# EasyEDA Pro project ProPrj_26-3-4手持装甲板_2026-06-27.epro

# Schematic Schematic2
Assembly Variant: Basic; Board Name: Board2; Create Date: 2026-03-23; Page Name: P1; Project Name: 26-3-4手持装甲板; Schematic Name: Schematic2; Update Date: 2026-03-23; BladeWidth: 10; Company: 嘉立创EDA; Page Size: A4; RegionStart: 1; ShowBorder: 1; TitleBlock: 1; TitleBlockPosition: 3; Version: V1.0; XRegionCount: 6; YRegionCount: 4
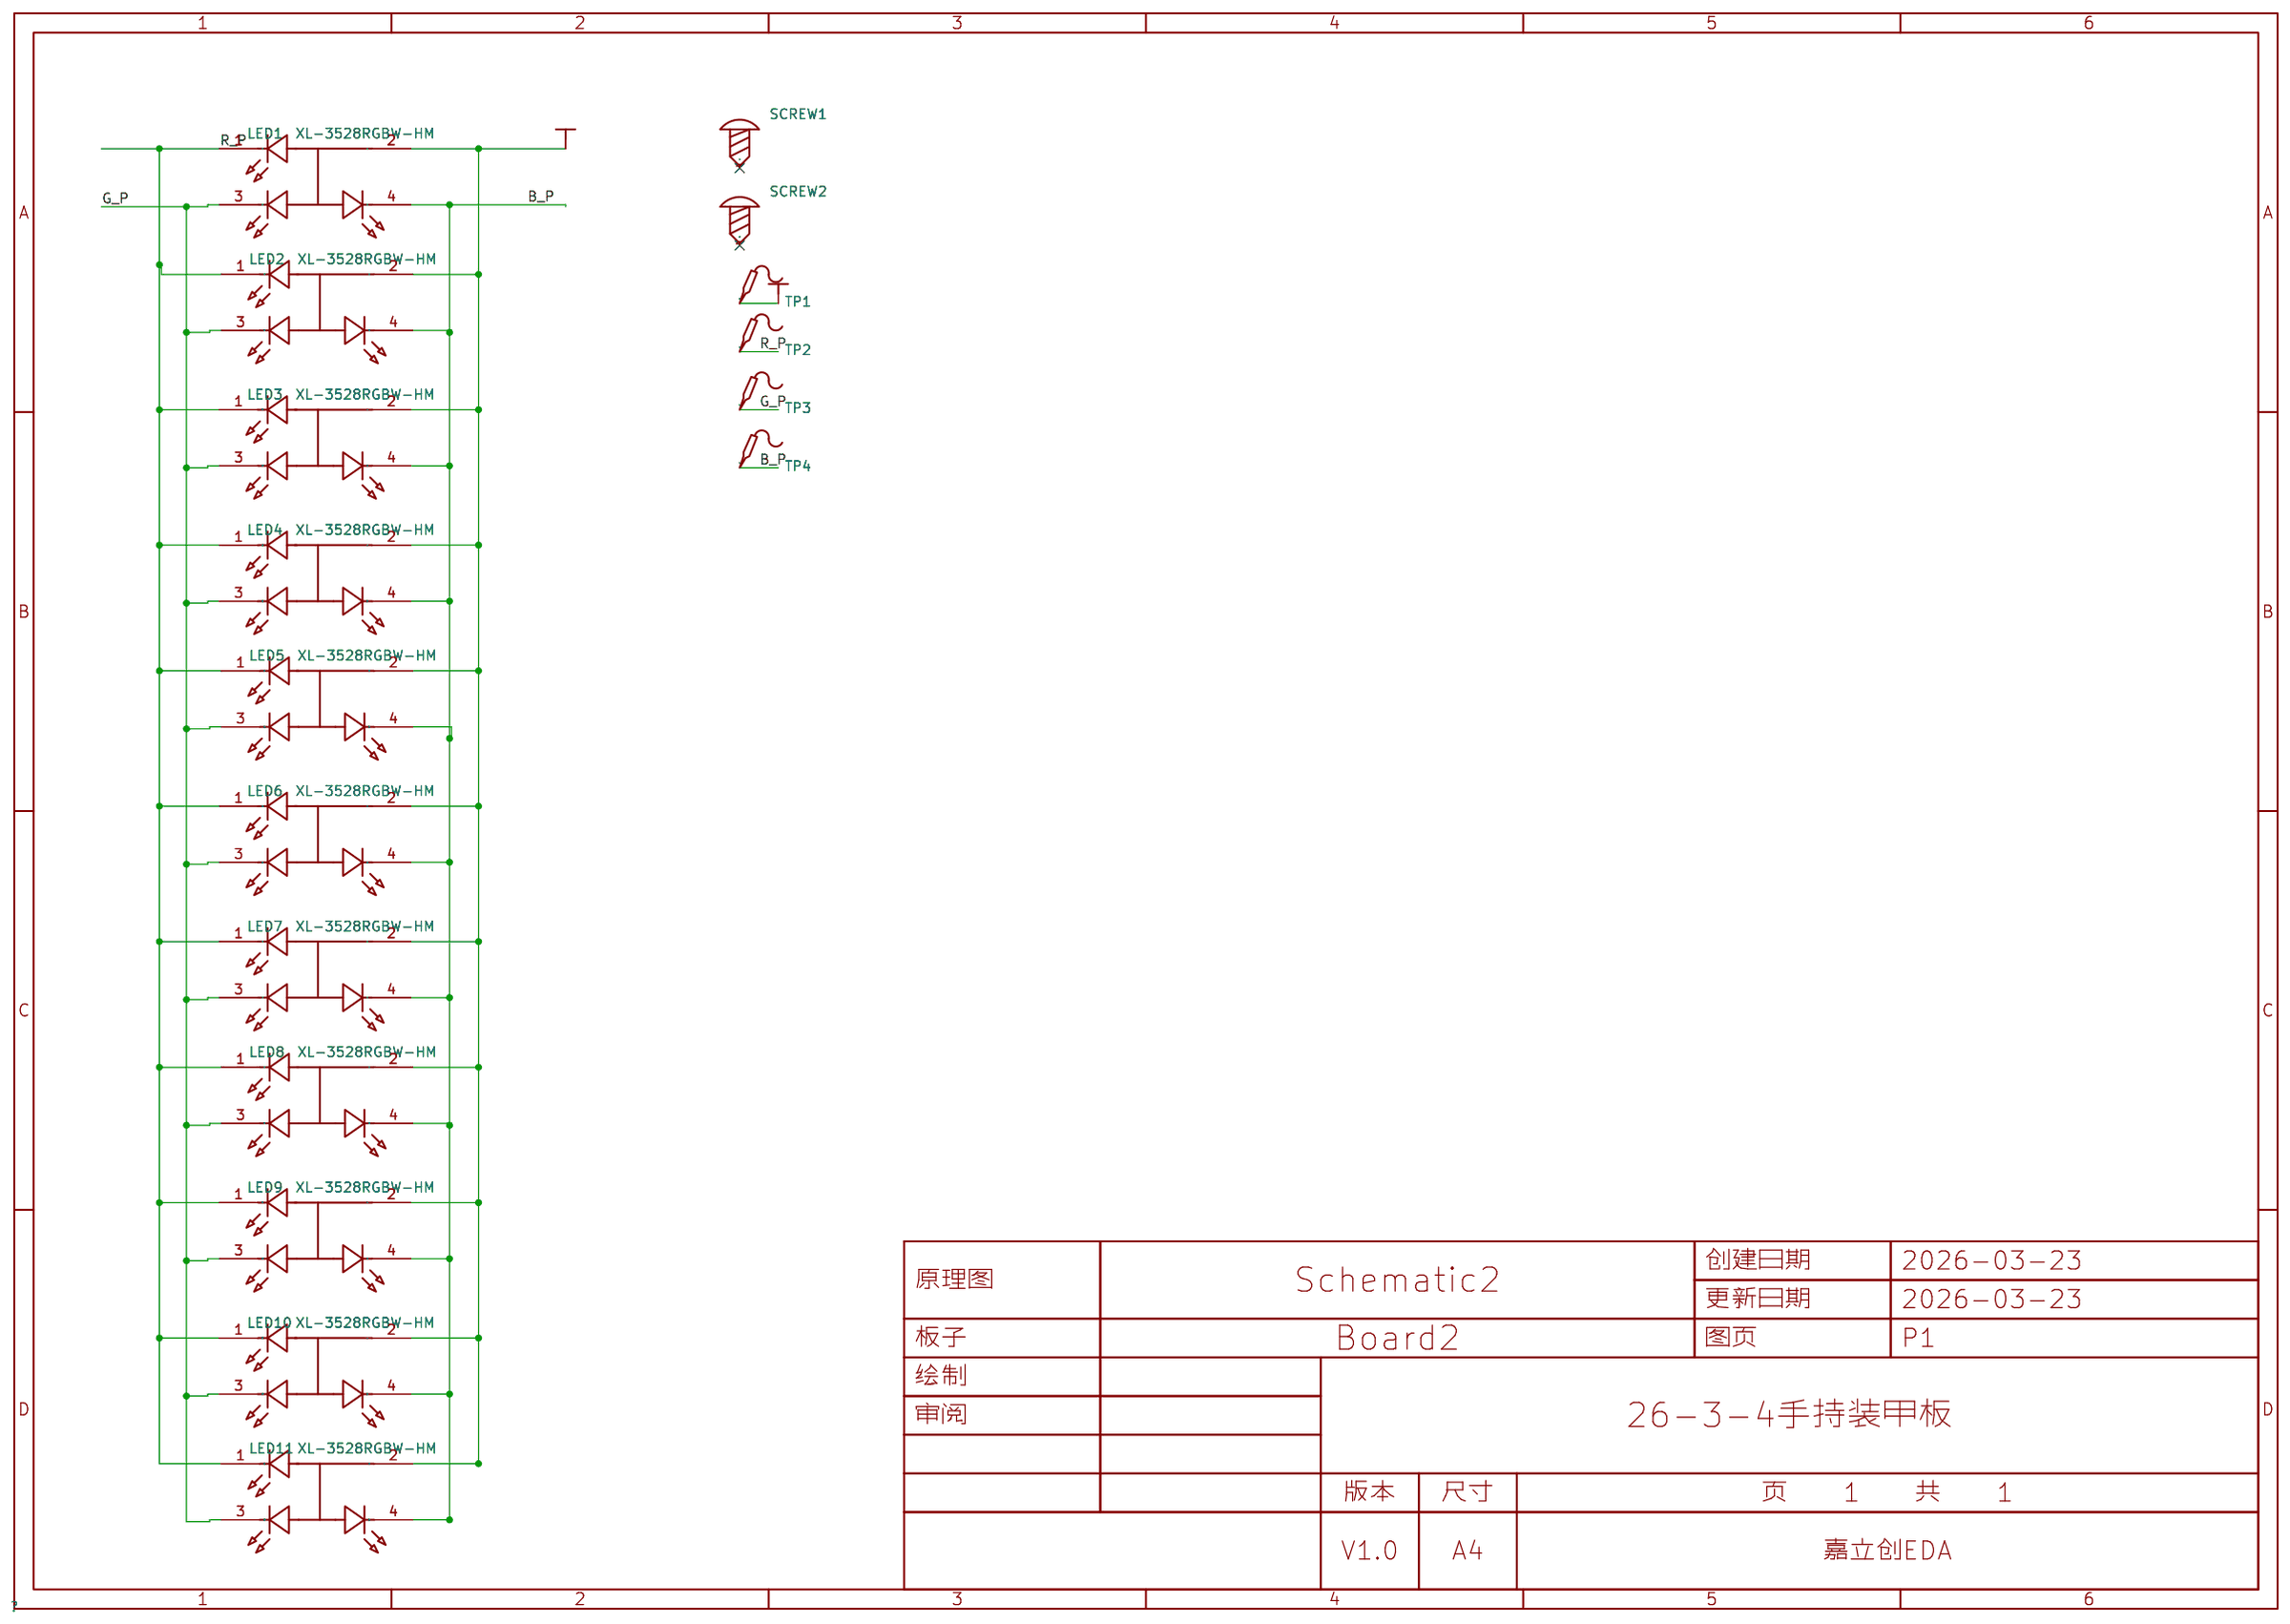
[diagram p0: schematic sheet]

## Parts
LED1  XL-3528RGBW-HM  [LED-SMD_4P-L3.2-W2.8-LS3.5-XL-3528RGBW-HM5]
LED2  XL-3528RGBW-HM  [LED-SMD_4P-L3.2-W2.8-LS3.5-XL-3528RGBW-HM5]
LED3  XL-3528RGBW-HM  [LED-SMD_4P-L3.2-W2.8-LS3.5-XL-3528RGBW-HM5]
LED4  XL-3528RGBW-HM  [LED-SMD_4P-L3.2-W2.8-LS3.5-XL-3528RGBW-HM5]
LED5  XL-3528RGBW-HM  [LED-SMD_4P-L3.2-W2.8-LS3.5-XL-3528RGBW-HM5]
LED6  XL-3528RGBW-HM  [LED-SMD_4P-L3.2-W2.8-LS3.5-XL-3528RGBW-HM5]
LED7  XL-3528RGBW-HM  [LED-SMD_4P-L3.2-W2.8-LS3.5-XL-3528RGBW-HM5]
LED8  XL-3528RGBW-HM  [LED-SMD_4P-L3.2-W2.8-LS3.5-XL-3528RGBW-HM5]
LED9  XL-3528RGBW-HM  [LED-SMD_4P-L3.2-W2.8-LS3.5-XL-3528RGBW-HM5]
LED10  XL-3528RGBW-HM  [LED-SMD_4P-L3.2-W2.8-LS3.5-XL-3528RGBW-HM5]
LED11  XL-3528RGBW-HM  [LED-SMD_4P-L3.2-W2.8-LS3.5-XL-3528RGBW-HM5]
SCREW1  -  [M2螺丝]
SCREW2  -  [M2螺丝]
TP1  -  [Test-Point-0.5mm]
TP2  -  [Test-Point-0.5mm]
TP3  -  [Test-Point-0.5mm]
TP4  -  [Test-Point-0.5mm]

## Library data of the parts
LED1-LED11 = XL-3528RGBW-HM: 3528七彩黑面贴片LED灯珠; LCSC Part Name: 3528七彩雾状共阳贴片式发光二极管; Supplier Part: C2843813; Manufacturer: XINGLIGHT(成兴光); Supplier Footprint: SMD3528-4P; JLCPCB Part Class: Extended Part; Datasheet: https://item.szlcsc.com/datasheet/XL-3528RGBW-HM/3033164.html; Supplier: LCSC; Diode Configuration: 共阳极; Wavelength - Dominant: G:515nm~530nm；B:460nm~475nm；R:620nm~630nm; Peak Wavelength: G:525nm；R:625nm；B:465nm; Luminous Intensity: B:120mcd~180mcd；G:400mcd~600mcd；R:150mcd~200mcd; Viewing Angle: 120°; Forward Current: R:20mA；B:20mA；G:20mA; Forward Voltage(Vf): R:1.8V~2.2V；G:2.9V~3.2V；B:3.0V~3.3V; Antistatic Capacity: B:2000V；R:2000V；G:2000V; Power(Watts): G:70mW；B:70mW；R:50mW; Installation Method: 正贴; Operating Temperature: -20℃~+85℃; Length: 3.5mm; Width: 2.8mm; Height: 1.9mm
SCREW1 SCREW2 = M2螺丝: Supplier Footprint: 插件
TP1-TP4 = Test-Point: Test Point 测试点

## Nets
+5V: LED1.2(+) LED2.2(+) LED3.2(+) LED4.2(+) LED5.2(+) LED6.2(+) LED7.2(+) LED8.2(+) LED9.2(+) LED10.2(+) LED11.2(+) TP1.1
B_P: LED1.4(B-) LED2.4(B-) LED3.4(B-) LED4.4(B-) LED5.4(B-) LED6.4(B-) LED7.4(B-) LED8.4(B-) LED9.4(B-) LED10.4(B-) LED11.4(B-) TP4.1
G_P: LED1.3(G-) LED2.3(G-) LED3.3(G-) LED4.3(G-) LED5.3(G-) LED6.3(G-) LED7.3(G-) LED8.3(G-) LED9.3(G-) LED10.3(G-) LED11.3(G-) TP3.1
R_P: LED1.1(R-) LED2.1(R-) LED3.1(R-) LED4.1(R-) LED5.1(R-) LED6.1(R-) LED7.1(R-) LED8.1(R-) LED9.1(R-) LED10.1(R-) LED11.1(R-) TP2.1

Not connected (* = marked no-connect by the designer): SCREW1 1*; SCREW2 1*

# Schematic Schematic1
Assembly Variant: Basic; Board Name: Board1; Create Date: 2026-03-04; Page Name: P1; Project Name: 26-3-4手持装甲板; Schematic Name: Schematic1; Update Date: 2026-03-04; BladeWidth: 10; Company: 嘉立创EDA; Page Size: A4; RegionStart: 1; ShowBorder: 1; TitleBlock: 1; TitleBlockPosition: 3; Version: V1.0; XRegionCount: 6; YRegionCount: 4
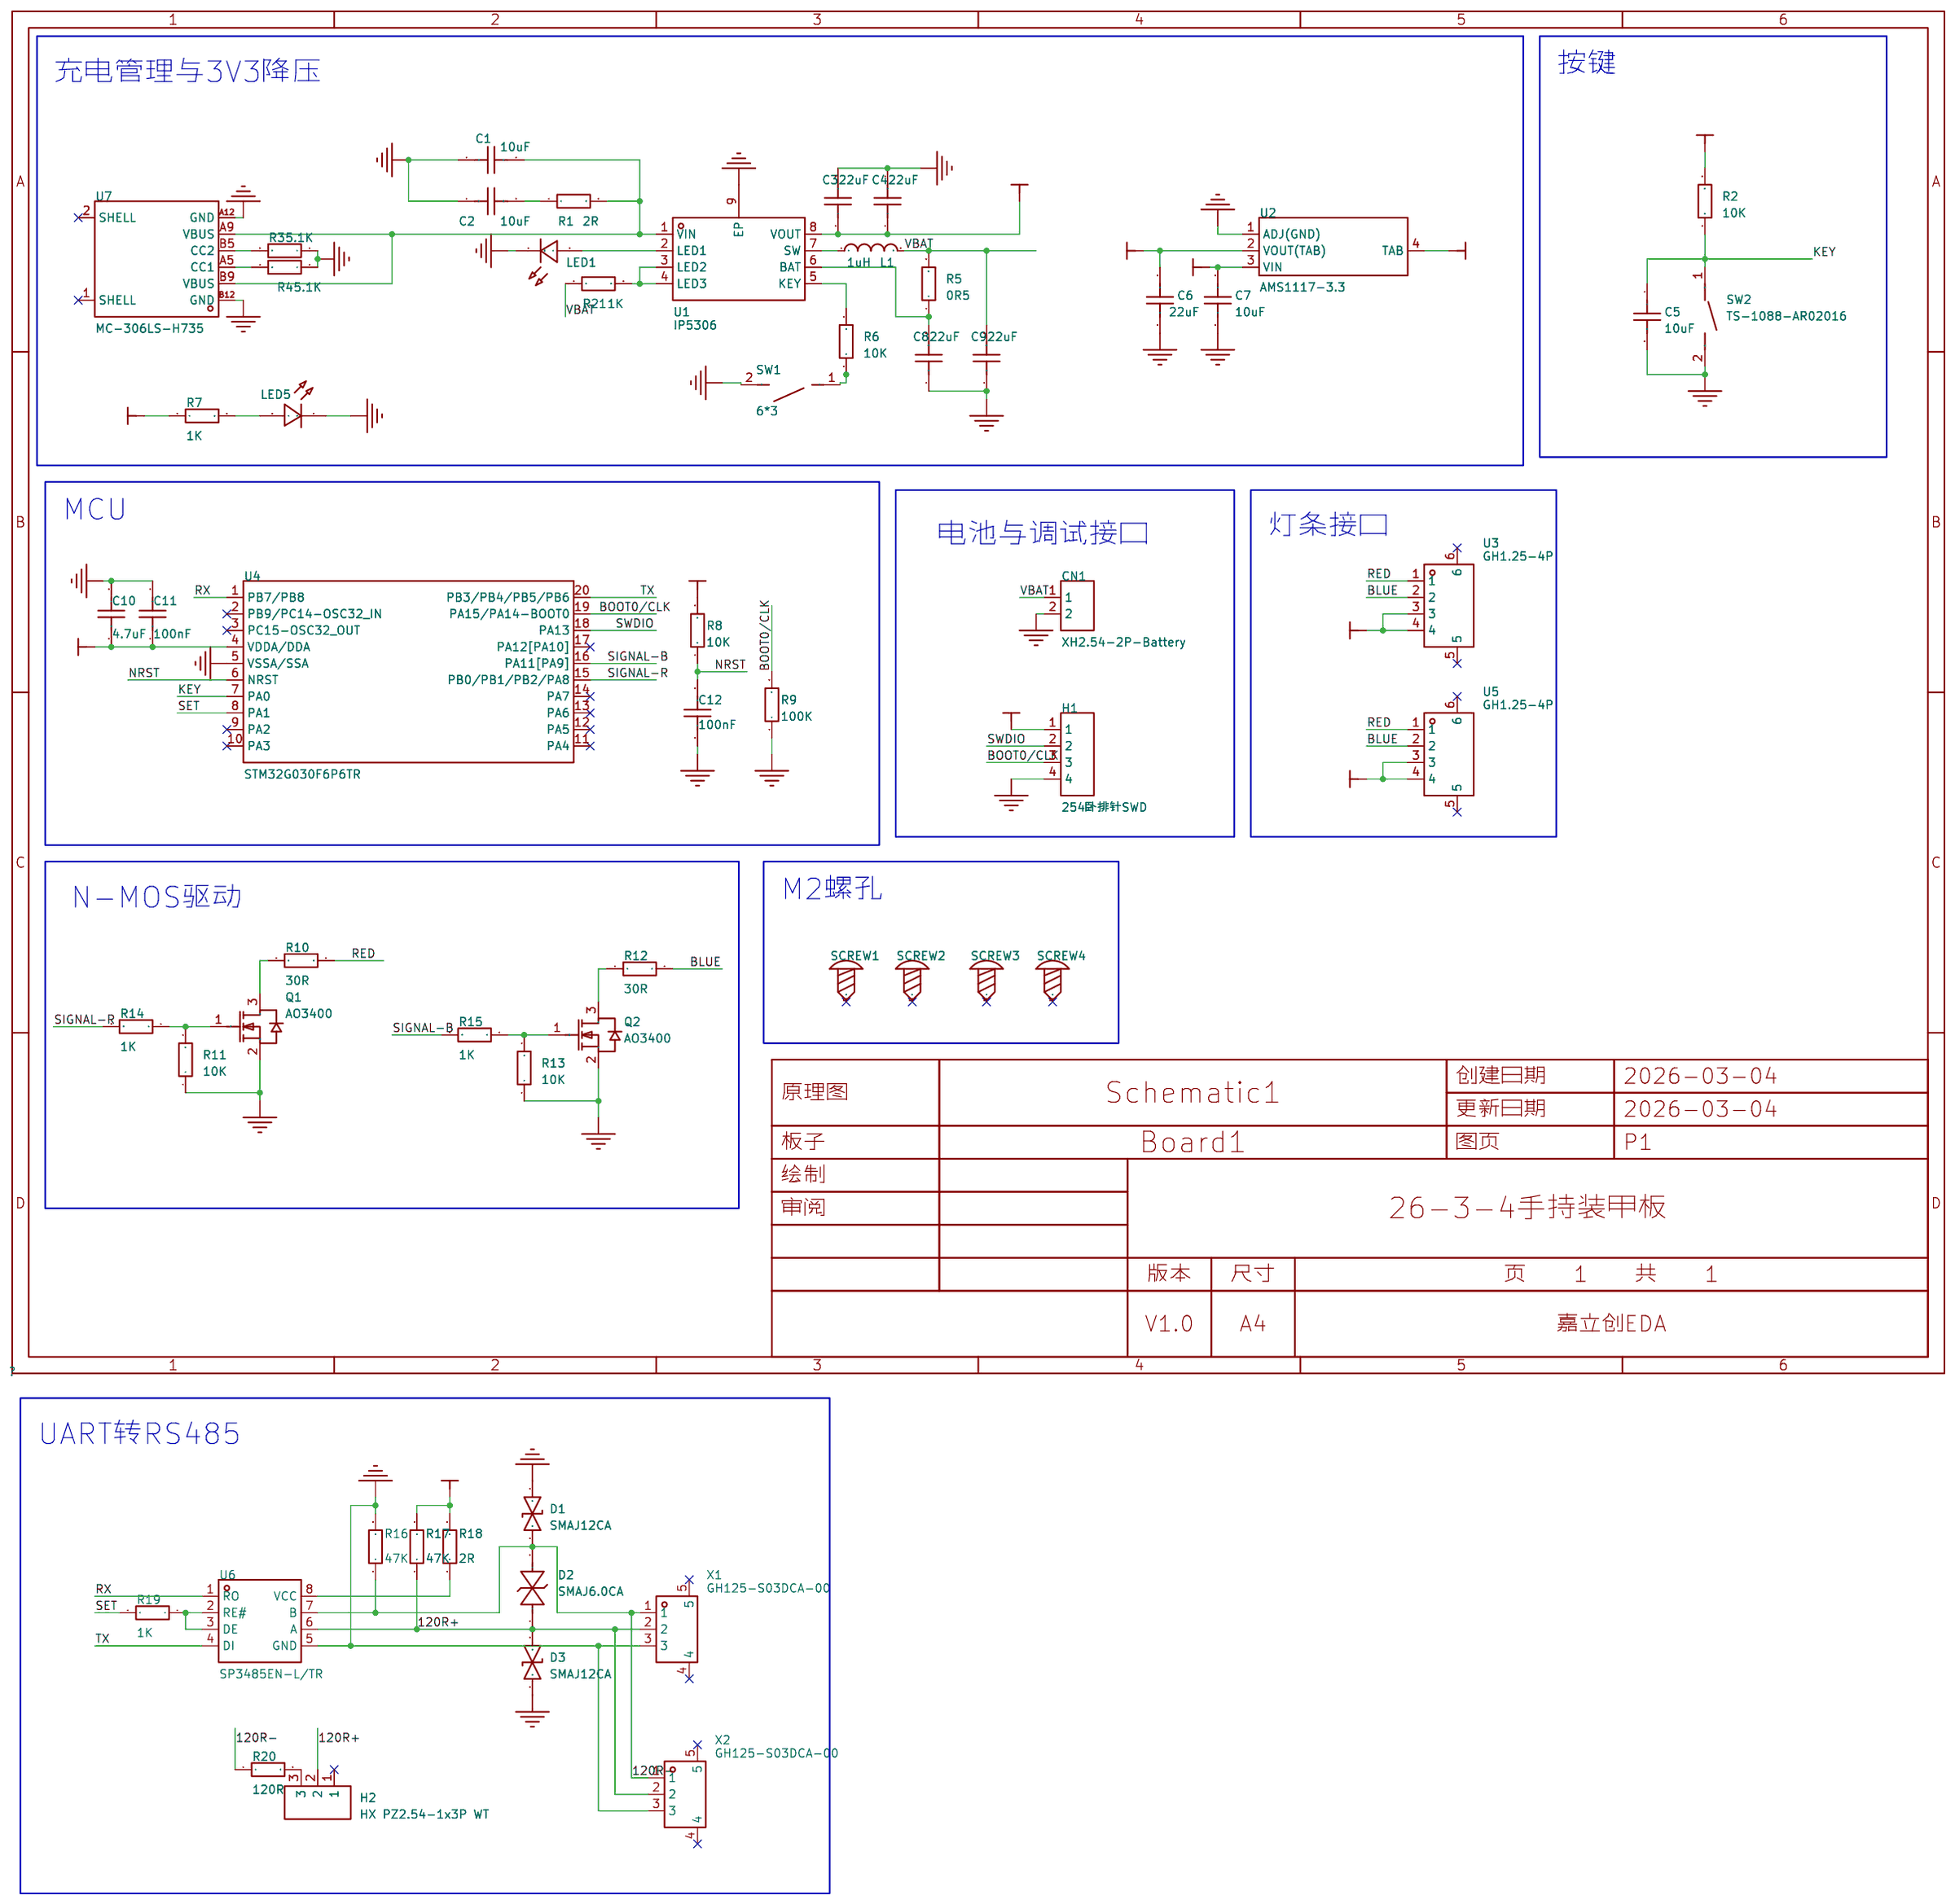
[diagram p1: schematic sheet]

## Parts
C1  10uF  [C0603]
C2  10uF  [C0603]
C3  22uF  [C0603]
C4  22uF  [C0603]
C5  10uF  [C0603]
C6  22uF  [C0603]
C7  10uF  [C0603]
C8  22uF  [C0603]
C9  22uF  [C0603]
C10  4.7uF  [C0603]
C11  100nF  [C0603]
C12  100nF  [C0603]
CN1  XH2.54-2P-Battery  [CONN-TH_2P-P2.50_HX-2.54MM-2P-ZZ-MS]
D1  SMAJ12CA  [SMA_L4.3-W2.6-LS5.0-BI]
D2  SMAJ6.0CA  [SMA_L4.3-W2.6-LS5.0-BI]
D3  SMAJ12CA  [SMA_L4.3-W2.6-LS5.0-BI]
H1  254卧排针SWD  [HDR-TH_4P-P2.54-H-M-W10.4]
H2  HX PZ2.54-1x3P WT  [HDR-SMD_3P-P2.54-H-M_KH-2.54PH-1X3P-L13.5-WT]
L1  1uH  [IND-SMD_L7.1-W6.6_DH0630H-R82M]
LED1  -  [LED_0603]
LED5  -  [LED_0603]
Q1  AO3400  [SOT-23_L2.9-W1.3-P1.90-LS2.4-BR]
Q2  AO3400  [SOT-23_L2.9-W1.3-P1.90-LS2.4-BR]
R1  2R  [R0603]
R2  10K  [R0603]
R3  5.1K  [R0603]
R4  5.1K  [R0603]
R5  0R5  [R0603]
R6  10K  [R0603]
R7  1K  [R0603]
R8  10K  [R0603]
R9  100K  [R0603]
R10  30R  [R0603]
R11  10K  [R0603]
R12  30R  [R0603]
R13  10K  [R0603]
R14  1K  [R0603]
R15  1K  [R0603]
R16  47K  [R0603]
R17  47K  [R0603]
R18  2R  [R0603]
R19  1K  [R0603]
R20  120R  [R0603]
R21  1K  [R0603]
SCREW1  -  [M2螺丝]
SCREW2  -  [M2螺丝]
SCREW3  -  [M2螺丝]
SCREW4  -  [M2螺丝]
SW1  6*3  [SW-SMD_L6.1-W3.6-LS7.0_YTS1C0161BBJ00]
SW2  TS-1088-AR02016  [SW-SMD_L3.9-W3.0-P4.45]
U1  IP5306  [ESOP-8_L4.9-W3.9-P1.27-LS6.0-BL-EP]
U2  AMS1117-3.3  [SOT-223-4_L6.5-W3.5-P2.30-LS7.0-BR]
U3  GH1.25-4P  [CONN-SMD_4P-P1.25_XUNPU_WAFER-GH1.25-4PWB]
U4  STM32G030F6P6TR  [TSSOP-20_L6.5-W4.4-P0.65-LS6.4-BL]
U5  GH1.25-4P  [CONN-SMD_4P-P1.25_XUNPU_WAFER-GH1.25-4PWB]
U6  SP3485EN-L/TR  [SOIC-8_L5.0-W4.0-P1.27-LS6.0-BL]
U7  MC-306LS-H735  [USB-C-SMD_MC-306LS-H60]
X1  GH125-S03DCA-00  [CONN-SMD_3P-P1.25_JUSHUO_GH125-S03DCA-00]
X2  GH125-S03DCA-00  [CONN-SMD_3P-P1.25_JUSHUO_GH125-S03DCA-00]

## Library data of the parts
C1-C5 C8-C12 = CAP_0603: Supplier Footprint: 0603
C6 C7 = CGA0603X7R104K500JT: 容值:100nF;精度:±10%;额定电压:50V;温度系数:X7R;; LCSC Part Name: 100nF ±10% 50V; Supplier Part: C6119867; Manufacturer: HRE(芯声); Supplier Footprint: 0603; JLCPCB Part Class: Extended Part; Datasheet: https://item.szlcsc.com/datasheet/CGA0603X7R104K500JT/7062573.html; Supplier: LCSC; Tolerance: ±10%; Voltage Rating: 50V; Temperature Coefficient: X7R
CN1 = HX-XH2.54-2PZZ: 插针结构:1x2P;间距:2.54mm;安装方式:直插;参考系列:XH;总PIN数:2P;排数:1;每排PIN数:2;行距:-;额定电流:3A;触头材质:黄铜;触头镀层:锡;工作温度:-25℃~+85℃;; LCSC Part Name: 1x2P 间距:2.5mm 直插 系列:XH; Supplier Part: C42391660; Manufacturer: hanxia(韩下); Supplier Footprint: 插件,P=2.5mm; JLCPCB Part Class: Extended Part; Datasheet: https://item.szlcsc.com/datasheet/HX-XH2.54-2PZZ/44326932.html; Supplier: LCSC; Pins Structure: 1x2P; Pitch: 2.54mm; Mounting Type: 直插; Reference Series: XH; Number of Pins: 2P; Number of Rows: 1; Number of PINs Per Row: 2; Current Rating: 3A; Contact Material: 黄铜; Contact Plating: 锡; Operating Temperature: -25℃~+85℃; Voltage Rating: 250V; Plastic Material: PA66; Flame Retardant Rating: UL94V-0; Color: 白色
D1 D3 = SMAJ12CA_C19077532: 极性:双向;反向截止电压(Vrwm):12V;钳位电压:19.9V;峰值脉冲电流(Ipp):20.1A@10/1000us;峰值脉冲功率(Ppp):400W@10/1000us;击穿电压:14.7V;; LCSC Part Name: 双向TVS 12V截止 峰值浪涌电流：20.1A@10/1000us; Supplier Part: C19077532; Manufacturer: R+O(宏嘉诚); Supplier Footprint: DO-214AC(SMA); JLCPCB Part Class: Extended Part; Datasheet: https://item.szlcsc.com/datasheet/SMAJ12CA/20275617.html; Supplier: LCSC; Polarity: 双向; Reverse Stand-Off Voltage (Vrwm): 12V; Clamping Voltage: 19.9V; Peak Pulse Current (Ipp): 20.1A@10/1000us; Peak Pulse Power Dissipation (Ppp): 400W@10/1000us; Voltage - Breakdown: 14.7V; Reverse Leakage Current (Ir): 1uA; Number of Channels: 单路; Operating Temperature: -55℃~+150℃; level of protection: IEC 61000-4-2; Type: TVS
D2 = SMAJ6.0CA_C19077526: 极性:双向;反向截止电压(Vrwm):6V;钳位电压:10.3V;峰值脉冲电流(Ipp):38.8A@10/1000us;峰值脉冲功率(Ppp):400W@10/1000us;击穿电压:7.37V;; LCSC Part Name: 双向TVS 6V截止 峰值浪涌电流：38.8A@10/1000us; Supplier Part: C19077526; Manufacturer: R+O(宏嘉诚); Supplier Footprint: DO-214AC(SMA); JLCPCB Part Class: Extended Part; Datasheet: https://item.szlcsc.com/datasheet/SMAJ6.0CA/20275611.html; Supplier: LCSC; Polarity: 双向; Reverse Stand-Off Voltage (Vrwm): 6V; Clamping Voltage: 10.3V; Peak Pulse Current (Ipp): 38.8A@10/1000us; Peak Pulse Power Dissipation (Ppp): 400W@10/1000us; Voltage - Breakdown: 7.37V; Reverse Leakage Current (Ir): 800uA; Number of Channels: 单路; Operating Temperature: -55℃~+150℃; level of protection: IEC 61000-4-2; Type: TVS
H1 = PZ254R-11-04P: 插针结构:1x4P;间距:2.54mm;行距:-;圆针/方针:方针;安装方式:弯插;排数:单排;总PIN位数:4P;额定电流:-;额定电压:-;配合针长度:6mm;塑高:2.5mm;触头材质:黄铜;触头镀层:-;工作温度:-40℃~+105℃;颜色:黑色;; LCSC Part Name: 1x4P 间距:2.54mm 方针 弯插; Supplier Part: C492412; Manufacturer: XFCN(兴飞); Supplier Footprint: 弯插,P=2.54mm; JLCPCB Part Class: Extended Part; Datasheet: https://item.szlcsc.com/datasheet/PZ254R-11-04P/502968.html; Supplier: LCSC; Pin Structure: 1x4P; Pitch: 2.54mm; Circluar Pins/Square Pins: 方针; Mounting Type: 弯插; Number of Rows: 单排; Number of Pins: 4P; Length of Mating Pin: 6mm; Insulation Height: 2.5mm; Contact Material: 黄铜; Operating Temperature: -40℃~+105℃; Color: 黑色
H2 = HX PZ2.54-1x3P WT: 插针结构:1x3P;间距:2.54mm;行距:-;圆针/方针:方针;安装方式:卧贴;排数:单排;总PIN位数:3P;额定电流:3A;额定电压:1kV;配合针长度:6mm;塑高:2.5mm;端接针长度:-;触头材质:黄铜;触头镀层:金;工作温度:-40℃~+105℃;颜色:黑色;; LCSC Part Name: 配套排母：HX PM2.54-1x3P系列 1x3P 间距:2.54mm 方针 卧贴; Supplier Part: C46061676; Manufacturer: hanxia(韩下); Supplier Footprint: SMD,P=2.54mm,卧贴; JLCPCB Part Class: Extended Part; Datasheet: https://item.szlcsc.com/datasheet/HX%2520PZ2.54-1x3P%2520WT/48170536.html; Supplier: LCSC; Pin Structure: 1x3P; Pitch: 2.54mm; Circluar Pins/Square Pins: 方针; Mounting Type: 卧贴; Number of Rows: 单排; Number of Pins: 3P; Current Rating: 3A; Voltage Rating (Max): 1kV; Length of Mating Pin: 6mm; Insulation Height: 2.5mm; Contact Material: 黄铜; Contact Plating: 金; Operating Temperature: -40℃~+105℃; Color: 黑色
L1 = DH0630H-R82M: 电感值:820nH;精度:±20%;额定电流:11A;饱和电流(Isat):20A;类型:一体成型电感;; LCSC Part Name: DH0630H-R82M（0.82uH); Supplier Part: C41407091; Manufacturer: DH(德鸿感应); Supplier Footprint: SMD,7.1x6.6mm; Datasheet: https://item.szlcsc.com/datasheet/DH0630H-R82M/43206132.html; Supplier: LCSC; Tolerance: ±20%; Current Rating: 11A; Current - Saturation(Isat): 20A; DC Resistance(DCR): 5.6mΩ; Type: 一体成型电感
LED1 LED5 = LED_0603-G: Supplier Footprint: 0603
Q1 Q2 = AO3400_C2938367: 数量:1个N沟道;漏源电压(Vdss):30V;连续漏极电流(Id):5.8A;导通电阻(RDS(on)):28mΩ@10V;耗散功率(Pd):1.5W;阈值电压(Vgs(th)):1.4V@250uA;; LCSC Part Name: 1个N沟道 耐压:30V 电流:5.8A; Supplier Part: C2938367; Manufacturer: GOODWORK(固得沃克); Supplier Footprint: SOT-23; JLCPCB Part Class: Extended Part; Datasheet: https://item.szlcsc.com/datasheet/AO3400/3294704.html; Supplier: LCSC; Number: 1个N沟道; Drain to Source Voltage: 30V; Current - Continuous Drain(Id): 5.8A; RDS(on): 28mΩ@10V; Pd - Power Dissipation: 1.5W; Gate Threshold Voltage (Vgs(th)): 1.4V@250uA; Input Capacitance(Ciss): 1.05nF; Reverse Transfer Capacitance (Crss@Vds): 77pF@15V; Operating Temperature: -55℃~+150℃; Type: N沟道
R1-R21 = Res_0603: Supplier Footprint: 0603
SCREW1-SCREW4 = M2螺丝: Supplier Footprint: 插件
SW1 = YTS1C0161BBJ00: 电路结构:单刀单掷;按钮形状:矩形按钮;作用力:1.8N;安装方式:立贴;开关长度:6mm;开关宽度:3mm;开关高度:5mm;带支架:不带支架;触点电流:50mA;额定电压:12V;带灯:无;; LCSC Part Name: 3X6X5 160gf 黑钮翘脚; Supplier Part: C5451708; Manufacturer: YIYUAN(怡远); Supplier Footprint: SMD,6x3mm; JLCPCB Part Class: Extended Part; Datasheet: https://item.szlcsc.com/datasheet/YTS1C0161BBJ00/6355620.html; Supplier: LCSC; Circuit: 单刀单掷; Actuator Style: 矩形按钮; Operating Force: 1.8N; Mounting Type: 立贴; Length: 6mm; Width: 3mm; Switch Height: 5mm; with Bracket: 不带支架; Contact Current: 50mA; Voltage Rating: 12V; Actuator/Cap Color: 黑色; With Lamp: 无; Termination Style: J型引脚
SW2 = TS-1088-AR02016: 电路结构:单刀单掷;按钮形状:圆形按钮;作用力:1.6N;安装方式:立贴;开关长度:4mm;开关宽度:3mm;开关高度:2mm;带支架:不带支架;触点电流:50mA;额定电压:12V;工作寿命:10万次;; LCSC Part Name: 4*3*2mm 立贴 轻触开关; Supplier Part: C720477; Manufacturer: XUNPU(讯普); Supplier Footprint: SMD,4x3mm; JLCPCB Part Class: Basic Part; Datasheet: https://item.szlcsc.com/datasheet/TS-1088-AR02016/763484.html; Supplier: LCSC; Circuit: 单刀单掷; Actuator Style: 圆形按钮; Operating Force: 1.6N; Mounting Type: 立贴; Length: 4mm; Width: 3mm; Switch Height: 2mm; with Bracket: 不带支架; Contact Current: 50mA; Voltage Rating: 12V; Actuator/Cap Color: 黑色; Termination Style: SMD接片; Life: 10万次; Operating Temperature: -30℃~+80℃
U1 = IP5306: 工作电压:4.65V~5.5V;最大充电电流:2.1A;电池类型:锂电池;电池节数:1;; LCSC Part Name: 集成2.1A充电器和2.1A放电器的全集成移动电源系统级芯片; Supplier Part: C181692; Manufacturer: INJOINIC(英集芯); Supplier Footprint: ESOP-8; JLCPCB Part Class: Extended Part; Datasheet: https://item.szlcsc.com/datasheet/IP5306/193089.html; Supplier: LCSC; The Chip Type: 充电芯片；保护芯片; Voltage - Supply: 4.65V~5.5V; Charge Current - Max: 2.1A; Charging Saturation Voltage: 4.2V; End-Off Voltage: 3V; Type of Battery: 锂电池; Number of Cells: 1; Operating Temperature: 0℃~+70℃; Supply Current (Iq): 100uA; Interface: I2C
U2 = AMS1117-3.3_C347222: 输出类型:固定;工作电压:12V;输出电压:3.3V;输出电流:1A;电源纹波抑制比(PSRR):60dB@(120Hz);输出极性:正极;; LCSC Part Name: 3.3V 1A 12V; Supplier Part: C347222; Manufacturer: UMW(友台半导体); Supplier Footprint: SOT-223; JLCPCB Part Class: Extended Part; Datasheet: https://item.szlcsc.com/datasheet/AMS1117-3.3/323882.html; Supplier: LCSC; Output Type: 固定; Voltage - Supply: 12V; Output Voltage: 3.3V; Output Current: 1A; Power Supply Rejection Ratio (PSRR): 60dB@(120Hz); Voltage Dropout: 1.3V@(1A); standby current: 5mA; Noise: 0.003%Vout; Features: 过流保护; Operating Temperature: -40℃~+125℃; Output Configuration: 正极; Number of Outputs: 1
U3 U5 = WAFER-GH1.25-4PWB: 插针结构:1x4P;间距:1.25mm;安装方式:卧贴;参考系列:GH;总PIN数:4P;排数:1;每排PIN数:4;行距:-;额定电流:1A;触头材质:黄铜;触头镀层:锡;工作温度:-25℃~+85℃;; LCSC Part Name: 1x4P 间距:1.25mm 卧贴 系列:GH; Supplier Part: C3029379; Manufacturer: XUNPU(讯普); Supplier Footprint: SMD,P=1.25mm,卧贴; JLCPCB Part Class: Extended Part; Datasheet: https://item.szlcsc.com/datasheet/WAFER-GH1.25-4PWB/3561391.html; Supplier: LCSC; Pins Structure: 1x4P; Pitch: 1.25mm; Mounting Type: 卧贴; Reference Series: GH; Number of Pins: 4P; Number of Rows: 1; Number of PINs Per Row: 4; Current Rating: 1A; Contact Material: 黄铜; Contact Plating: 锡; Operating Temperature: -25℃~+85℃; Voltage Rating: 125V; Plastic Material: LCP; Supplementary Features: 辅助焊脚; Color: 米色; Z-Height of the Board: 4.35mm; X-Length of Bottom Edge on Board (Spacing Line): 8.25mm; Y-Width of Bottom Edge on Board: 5mm
U4 = STM32G030F6P6TR: CPU内核:-;CPU最大主频:64MHz;; LCSC Part Name: 主流超值系列Arm Cortex-M0+ MCU，具有32 KB Flash存储器、8 KB RAM、64 MHz CPU、2x USART、定时器、ADC和通信接口，2-3.6V; Supplier Part: C529330; Manufacturer: ST(意法半导体); Supplier Footprint: TSSOP-20; JLCPCB Part Class: Extended Part; Datasheet: https://item.szlcsc.com/datasheet/STM32G030F6P6TR/549608.html; Supplier: LCSC; CPU Maximum Speed: 64MHz; Program Storage Size: 32KB; Program Memory Type: FLASH; Number of I/O: 17; ADC (Bit): 12bit; Voltage - Supply: 2V~3.6V
U6 = SP3485EN-L/TR: 类型:收发器;数据速率:10Mbps;; LCSC Part Name: SP3485 +3.3V低功耗半双工RS-485收发器，数据速率10Mbps; Supplier Part: C8963; Manufacturer: MaxLinear(迈凌); Supplier Footprint: SOIC-8; JLCPCB Part Class: Basic Part; Datasheet: https://item.szlcsc.com/datasheet/SP3485EN-L%252FTR/9482.html; Supplier: LCSC; Type: 收发器; Number of Drivers: 1; Number of Receivers: 1; Voltage - Supply: 3.3V; Data Rate: 10Mbps; Number of Nodes: 32; Operating Temperature: -40℃~+85℃; Supply Current (Iq): 2mA; Communication Mode: 半双工
U7 = MC-306LS-H735: 连接器类型:Type-C;协议标准:-;公母:母;安装方式:立贴;触点数量:6P;端口数量:1;额定电流 - 电源:3A;工作温度:-25℃~+85℃;; LCSC Part Name: Type-C 母 立贴; Supplier Part: C6332266; Manufacturer: HANBO(汉博); Supplier Footprint: SMD; JLCPCB Part Class: Extended Part; Datasheet: https://item.szlcsc.com/datasheet/MC-306LS-H735/7280506.html; Supplier: LCSC; Connector Type: Type-C; Gender: 母; Mounting Type: 立贴; Number of Contacts: 6P; Number of Ports: 1; Current Rating-Power: 3A; Voltage Rating: 20V; Connect-Disconnect Life: 3千次; Operating Temperature: -25℃~+85℃
X1 X2 = GH125-S03DCA-00: 插针结构:1x3P;间距:1.25mm;安装方式:卧贴;参考系列:GH;总PIN数:3P;排数:1;每排PIN数:3;行距:-;额定电流:1A;触头材质:磷青铜;触头镀层:锡;工作温度:-25℃~+85℃;; LCSC Part Name: 1x3P 间距:1.25mm 卧贴 系列:GH; Supplier Part: C2886766; Manufacturer: JS(钜硕电子); Supplier Footprint: SMD,P=1.25mm,卧贴; JLCPCB Part Class: Extended Part; Datasheet: https://item.szlcsc.com/datasheet/GH125-S03DCA-00/3101262.html; Supplier: LCSC; Pins Structure: 1x3P; Pitch: 1.25mm; Mounting Type: 卧贴; Reference Series: GH; Number of Pins: 3P; Number of Rows: 1; Number of PINs Per Row: 3; Current Rating: 1A; Contact Material: 磷青铜; Contact Plating: 锡; Operating Temperature: -25℃~+85℃; Voltage Rating: 50V; Plastic Material: LCP; Flame Retardant Rating: UL94V-0; Color: 米色; Z-Height of the Board: 4.05mm; X-Length of Bottom Edge on Board (Spacing Line): 7.05mm; Y-Width of Bottom Edge on Board: 4.25mm

## Nets
+3.3V: C6.1 C10.1 C11.1 H1.1 R2.2 R8.2 R17.2 R18.2 U2.2(VOUT(TAB)) U2.4(TAB) U4.4(VDDA/DDA)
+5V: C3.1 C4.1 C7.2 R7.1 U1.8(VOUT) U2.3(VIN) U3.3 U3.4 U5.3 U5.4
GND: C1.1 C2.1 C3.2 C4.2 C5.2 C6.2 C7.1 C8.1 C9.1 C10.2 C11.2 C12.1 CN1.2 D1.2 D3.1 H1.4 LED1.1(C) LED5.1(C) Q1.2(S) Q2.2(S) R3.1 R4.1 R9.1 R11.1 R13.1 R16.2 SW1.2 SW2.2 U1.9(EP) U2.1(ADJ(GND)) U4.5(VSSA/SSA) U6.5(GND) U7.A12(GND) U7.B12(GND) X1.3 X2.3
VBAT: C9.2 CN1.1 L1.2 R5.2 R21.1
120R+: D2.1(K) D3.2 H2.2 R17.1 U6.6(A) X1.2 X2.2
120R-: D1.1 D2.2(A) R16.1 R20.1 U6.7(B) X1.1 X2.1
BLUE: R12.2 U3.2 U5.2
BOOT0/CLK: H1.3 R9.2 U4.19(PA15/PA14-BOOT0)
KEY: C5.1 R2.1 SW2.1 U4.7(PA0)
NRST: C12.2 R8.1 U4.6(NRST)
RED: R10.2 U3.1 U5.1
RX: U4.1(PB7/PB8) U6.1(RO)
SET: R19.2 U4.8(PA1)
SIGNAL-B: R15.2 U4.16(PA11[PA9])
SIGNAL-R: R14.2 U4.15(PB0/PB1/PB2/PA8)
SWDIO: H1.2 U4.18(PA13)
TX: U4.20(PB3/PB4/PB5/PB6) U6.4(DI)
$1N12: R4.2 U7.A5(CC1)
$1N13: R3.2 U7.B5(CC2)
$1N16: C1.2 R1.2 U1.1(VIN) U7.A9(VBUS) U7.B9(VBUS)
$1N18: C2.2 R1.1
$1N30: L1.1 U1.7(SW)
$1N32: C8.2 R5.1 U1.6(BAT)
$1N34: R6.2 U1.5(KEY)
$1N36: R6.1 SW1.1
$1N44: LED5.2(A) R7.2
$1N72: Q1.1(G) R11.2 R14.1
$1N73: Q1.3(D) R10.1
$1N104: H2.3 R20.2
$1N114: R18.1 U6.8(VCC)
$1N119: R19.1 U6.2(RE#) U6.3(DE)
$1N129: Q2.1(G) R13.2 R15.1
$1N130: Q2.3(D) R12.1
$1N134: LED1.2(A) U1.2(LED1)
$1N135: R21.2 U1.3(LED2) U1.4(LED3)

Not connected (* = marked no-connect by the designer): H2 1*; SCREW1 1*; SCREW2 1*; SCREW3 1*; SCREW4 1*; U3 5* 6*; U4 2(PB9/PC14-OSC32_IN)* 3(PC15-OSC32_OUT)* 9(PA2)* 10(PA3)* 11(PA4)* 12(PA5)* 13(PA6)* 14(PA7)* 17(PA12[PA10])*; U5 5* 6*; U7 1(SHELL)* 2(SHELL)*; X1 4* 5*; X2 4* 5*

## Notes on the sheet
- 按键
- 充电管理与3V3降压
- MCU
- 灯条接口
- 电池与调试接口
- N-MOS驱动
- M2螺孔
- UART转RS485

# Board PCB2
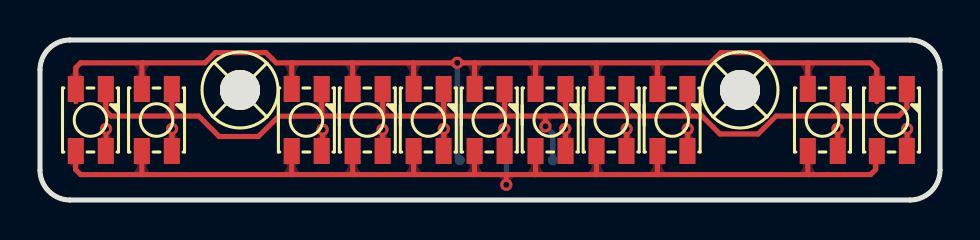
[diagram p2: board, top side]
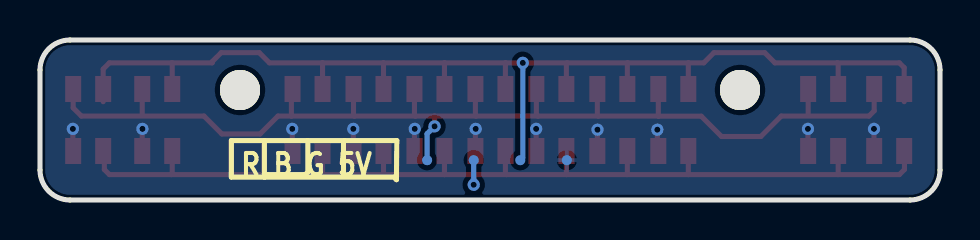
[diagram p3: board, bottom side, seen from below]

Outline 45 x 8 mm; copper layers: Top Layer, Bottom Layer. Coordinates in mm from the lower left corner of the outline.
Outline path: 0,6.5 0,1.5 arc(0.44,0.44) 1.5,0 43.5,0 arc(44.56,0.44) 45,1.5 45,6.5 arc(44.56,7.56) 43.5,8 1.5,8 arc(0.44,7.56) 0,6.5
Stack: Top Layer 0.035mm / Dielectric1 1.51mm FR4 er 4.5 / Bottom Layer 0.035mm

## Design rules (mm)
spacing copperThickness1oz (default): track to track 0.102, other pairs 0.152 to 0.3
spacing copperThickness2oz: track to track 0.203, other pairs 0.152 to 0.3
track width copperThickness1oz (default): min 0.127, default 0.254, max 2.54
track width copperThickness2oz: min 0.203, default 0.254, max 2.54
differential pair differentialPair (default): width min 0.127, default 0.254, max 2.54; gap min 0.152, default 0.152
net +5V uses copperRegion

## Placement (name value [footprint] x y rotation side)
LED1  XL-3528RGBW-HM  [LED-SMD_4P-L3.2-W2.8-LS3.5-XL-3528RGBW-HM5]  2.54 4 90 top
LED2  XL-3528RGBW-HM  [LED-SMD_4P-L3.2-W2.8-LS3.5-XL-3528RGBW-HM5]  5.84 4 90 top
LED3  XL-3528RGBW-HM  [LED-SMD_4P-L3.2-W2.8-LS3.5-XL-3528RGBW-HM5]  13.34 4 90 top
LED4  XL-3528RGBW-HM  [LED-SMD_4P-L3.2-W2.8-LS3.5-XL-3528RGBW-HM5]  16.38 4 90 top
LED5  XL-3528RGBW-HM  [LED-SMD_4P-L3.2-W2.8-LS3.5-XL-3528RGBW-HM5]  19.43 4 90 top
LED6  XL-3528RGBW-HM  [LED-SMD_4P-L3.2-W2.8-LS3.5-XL-3528RGBW-HM5]  22.48 4 90 top
LED7  XL-3528RGBW-HM  [LED-SMD_4P-L3.2-W2.8-LS3.5-XL-3528RGBW-HM5]  25.53 4 90 top
LED8  XL-3528RGBW-HM  [LED-SMD_4P-L3.2-W2.8-LS3.5-XL-3528RGBW-HM5]  28.57 4 90 top
LED9  XL-3528RGBW-HM  [LED-SMD_4P-L3.2-W2.8-LS3.5-XL-3528RGBW-HM5]  31.62 4 90 top
LED10  XL-3528RGBW-HM  [LED-SMD_4P-L3.2-W2.8-LS3.5-XL-3528RGBW-HM5]  39.14 4 90 top
LED11  XL-3528RGBW-HM  [LED-SMD_4P-L3.2-W2.8-LS3.5-XL-3528RGBW-HM5]  42.59 4 90 top
SCREW1  -  [M2螺丝]  10 5.5 0 top
SCREW2  -  [M2螺丝]  35 5.5 0 top
TP1  -  [Test-Point-0.5mm]  18.66 1.99 180 bottom
TP2  -  [Test-Point-0.5mm]  25.64 1.99 180 bottom
TP3  -  [Test-Point-0.5mm]  20.99 1.99 180 bottom
TP4  -  [Test-Point-0.5mm]  23.31 1.99 180 bottom

## Footprints (pads in the part's own frame, mm; a bottom-side part is the same pattern mirrored in y, then rotated)
LED-SMD_4P-L3.2-W2.8-LS3.5-XL-3528RGBW-HM5
  rect 1.3x0.8 smd: 1(1.55,-0.75) 2(-1.55,-0.75) 3(1.55,0.75) 4(-1.55,0.75)
M2螺丝
  round 2 hole 2: 1(0,0)
Test-Point-0.5mm
  round 0.5 smd: 1(0,0)

## Nets
As in the schematic.

Pads without a net: SCREW1 1; SCREW2 1

## Via types
v1: diameter 0.61, hole 0.305, Top Layer to Bottom Layer, 14 vias

## Routing (per net, layer and track width the routed paths; a pad name or vN(x,y) marks a point on that pad's centre or on a via; arc(x,y) is an arc through that point)
+5V: length 12.2
  Top Layer w0.254: v1(17.13,3.52) 17.13,3.51 LED4.2 ; LED2.2 6.6,2.46 v1(6.6,3.56) ; LED11.2 43.36,2.47 v1(43.36,3.56) ; LED6.2 23.23,3.54 v1(23.22,3.56) ; v1(39.88,3.56) 39.89,3.55 LED10.2 ; LED1.2 3.3,2.46 v1(3.3,3.56) ; LED9.2 32.39,2.46 v1(32.39,3.56) ; LED3.2 14.13,2.5 v1(14.13,3.52) ; LED8.2 29.34,2.46 v1(29.34,3.56) ; LED7.2 26.28,3.54 v1(26.26,3.56) ; LED5.2 20.19,2.46 v1(20.19,3.56)
B_P: length 55.5
  Top Layer w0.254: 18.68,1.27 15.66,1.27 ; 18.68,1.27 21.68,1.27 ; 18.68,1.27 18.68,2.45 ; 15.66,1.27 15.63,1.29 LED4.4 ; 15.66,1.27 12.59,1.27 ; 21.68,1.27 21.73,1.32 LED6.4 ; 21.68,1.27 23.28,1.27 ; 30.91,1.27 24.77,1.27 ; 30.91,1.27 30.87,1.3 LED9.4 ; 30.91,1.27 38.44,1.27 ; 41.84,2.96 41.78,2.9 41.78,1.52 41.53,1.27 38.44,1.27 ; 5.1,1.27 2.03,1.27 1.78,1.52 1.78,2.95 1.79,2.96 ; 5.1,1.27 12.59,1.27 ; 5.1,1.27 5.09,1.28 LED2.4 ; LED7.4 24.78,1.27 24.77,1.27 ; 24.77,1.27 23.28,1.27 ; 38.44,1.27 38.39,1.32 LED10.4 ; 23.28,1.27 23.31,1.24 v1(23.31,0.76) ; 12.59,1.27 12.59,1.28 LED3.4 ; LED8.4 27.82,1.27
  Bottom Layer w0.254: TP4.1 v1(23.31,0.76)
G_P: length 61.2
  Top Layer w0.254: 15.62,6.86 15.63,6.85 LED4.3 ; 15.62,6.86 12.58,6.86 ; 15.62,6.86 18.65,6.86 ; 38.4,6.86 41.53,6.86 41.84,6.55 41.84,4.92 ; 38.4,6.86 38.39,6.84 LED10.3 ; 38.4,6.86 36.39,6.86 36.39,6.92 35.94,7.37 34.04,7.37 33.53,6.86 30.87,6.86 ; 1.79,4.92 1.79,6.62 2.03,6.86 5.13,6.86 ; 18.65,6.86 18.68,6.82 LED5.3 ; 18.65,6.86 v1(20.86,6.86) 21.73,6.86 ; 27.83,6.86 30.87,6.86 ; 27.83,6.86 24.78,6.86 ; 27.83,6.86 27.82,6.85 LED8.3 ; 30.87,6.86 30.87,6.86 LED9.3 ; 12.58,6.86 12.59,6.86 LED3.3 ; 12.58,6.86 11.81,6.86 11.3,7.37 8.76,7.37 8.25,6.86 5.13,6.86 ; 21.73,6.86 24.78,6.86 ; 21.73,6.86 21.73,6.86 LED6.3 ; 24.78,6.86 24.78,6.86 LED7.3 ; LED2.3 5.09,6.82 5.13,6.86
  Bottom Layer w0.254: TP3.1 20.86,2.12 v1(20.86,6.86)
R_P: length 58.4
  Top Layer w0.254: 26.23,4.2 23.2,4.2 ; 26.23,4.2 26.28,4.24 LED7.1 ; 26.23,4.2 29.28,4.2 ; 23.2,4.2 20.1,4.2 ; 23.2,4.2 23.23,4.22 LED6.1 ; 20.1,4.2 17.09,4.2 ; 20.1,4.2 20.18,4.28 LED5.1 ; 32.43,4.2 32.43,5.49 LED9.1 ; 32.43,4.2 33.1,4.2 34,3.3 35.91,3.3 36.8,4.2 42.93,4.2 43.34,4.61 LED11.1 ; 32.43,4.2 29.28,4.2 ; LED8.1 29.32,4.24 29.28,4.2 ; 17.09,4.2 14.07,4.2 ; 17.09,4.2 17.13,4.24 LED4.1 ; 14.07,4.2 14.07,4.19 11.94,4.19 10.92,3.17 8.96,3.17 7.94,4.2 3.55,4.2 3.29,4.46 LED1.1 ; 14.07,4.2 14.09,4.21 LED3.1 ; v1(25.27,3.68) 25.27,4.2 ; LED10.1 39.89,4.32 ; LED2.1 6.59,4.32
  Bottom Layer w0.254: TP2.1 25.64,3.31 v1(25.27,3.68)

## Copper pours and planes (outline as drawn; the poured copper is in the pictures)
+5V on Bottom Layer: -1.14,11.05 46.1,11.05 46.35,11.3 46.35,-1.14 48.26,-3.05 0.51,-3.05 -1.78,-0.76 -1.14,-0.13

Small or netless copper shapes (teardrops, artwork), in the pictures only: 88 on Top Layer, 3 on Bottom Layer

## Text on the board
Bottom Silkscreen Layer: R B G 5V

# Board PCB1
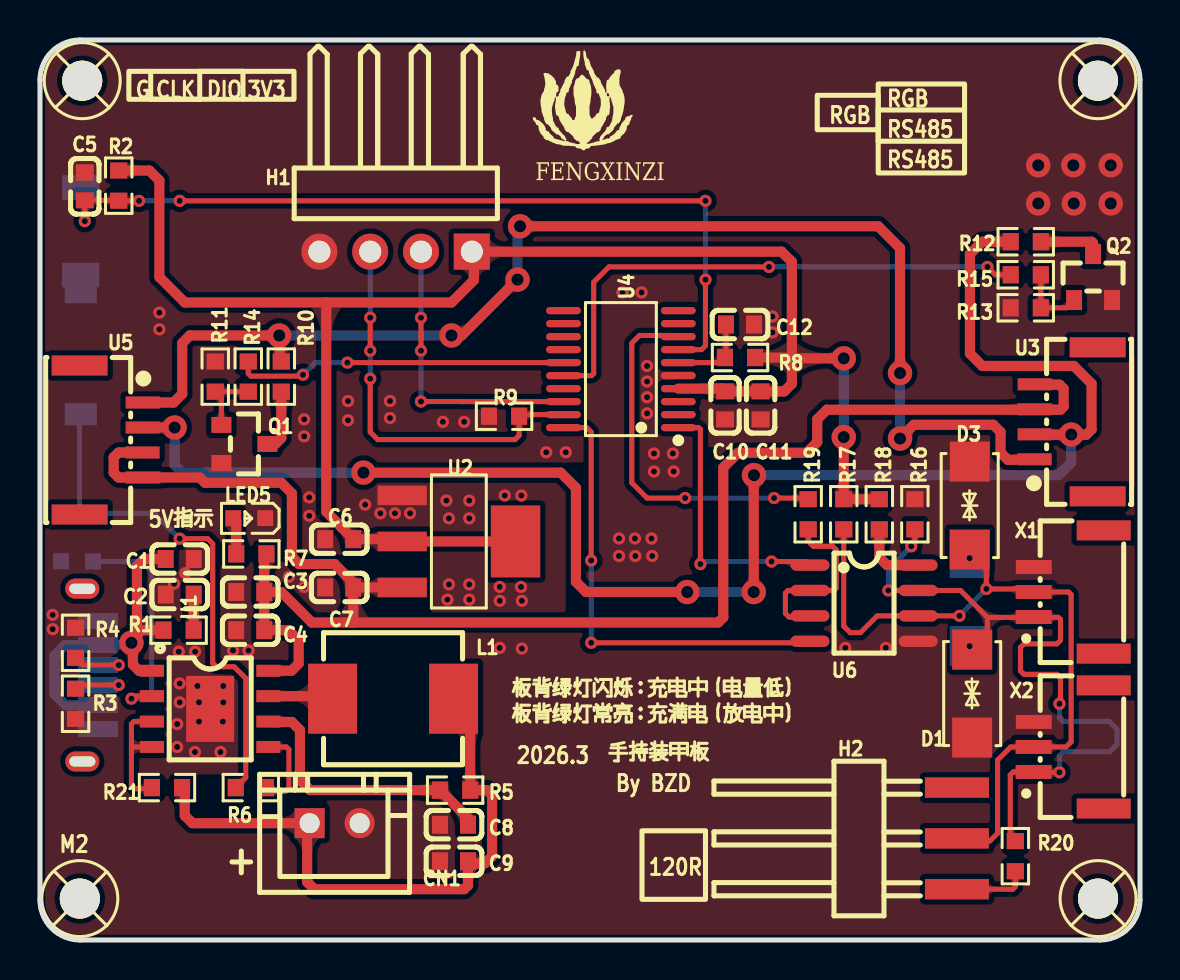
[diagram p4: board, top side]
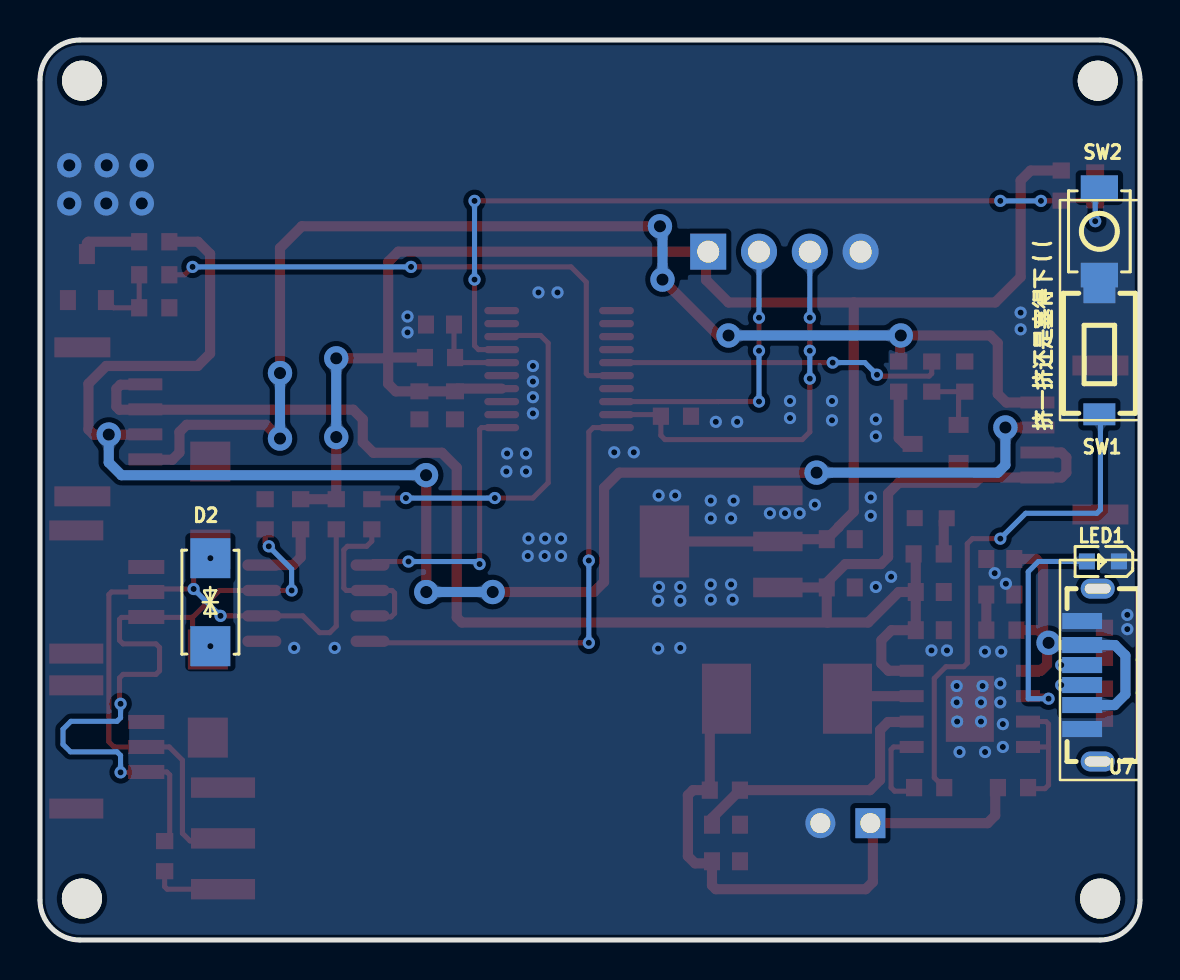
[diagram p5: board, bottom side, seen from below]

Outline 55 x 45 mm; copper layers: Top Layer, Bottom Layer. Coordinates in mm from the lower left corner of the outline.
Outline path: 0,43 0,2 arc(0.59,0.59) 2,0 53,0 arc(54.41,0.59) 55,2 55,43 arc(54.41,44.41) 53,45 2,45 arc(0.59,44.41) 0,43
Stack: Top Layer 0.035mm / Dielectric1 1.51mm FR4 er 4.5 / Bottom Layer 0.035mm

## Design rules (mm)
net 120R+: DP1
net 120R-: DP1
spacing copperThickness1oz (default): track to track 0.102, other pairs 0.152 to 0.3
spacing copperThickness2oz: track to track 0.203, other pairs 0.152 to 0.3
track width copperThickness1oz (default): min 0.127, default 0.254, max 2.54
track width copperThickness2oz: min 0.203, default 0.254, max 2.54
track width POWER: min 0.127, default 0.508, max 2.54
differential pair differentialPair (default): width min 0.127, default 0.254, max 2.54; gap min 0.152, default 0.152
net $1N16 uses POWER
net GND uses copperRegion
net +5V uses POWER
net +3.3V uses POWER
net $1N32 uses POWER
net VBAT uses POWER
net $1N30 uses POWER
net $1N73 uses POWER
net RED uses POWER
net BLUE uses POWER
net $1N130 uses POWER

## Placement (name value [footprint] x y rotation side)
C1  10uF  [C0603]  6.98 19.05 180 top
C2  10uF  [C0603]  6.98 17.27 0 top
C3  22uF  [C0603]  10.51 17.4 180 top
C4  22uF  [C0603]  10.51 15.49 180 top
C5  10uF  [C0603]  2.24 37.68 90 top
C6  22uF  [C0603]  14.96 20.04 180 top
C7  10uF  [C0603]  14.96 17.63 0 top
C8  22uF  [C0603]  20.7 5.77 0 top
C9  22uF  [C0603]  20.7 3.94 0 top
C10  4.7uF  [C0603]  34.25 26.73 270 top
C11  100nF  [C0603]  36.03 26.73 270 top
C12  100nF  [C0603]  35 30.77 180 top
CN1  XH2.54-2P-Battery  [CONN-TH_2P-P2.50_HX-2.54MM-2P-ZZ-MS]  14.73 5.84 0 top
D1  SMAJ12CA  [SMA_L4.3-W2.6-LS5.0-BI]  46.61 12.32 270 top
D2  SMAJ6.0CA  [SMA_L4.3-W2.6-LS5.0-BI]  46.48 16.89 270 bottom
D3  SMAJ12CA  [SMA_L4.3-W2.6-LS5.0-BI]  46.49 21.72 270 top
H1  254卧排针SWD  [HDR-TH_4P-P2.54-H-M-W10.4]  17.78 34.42 180 top
H2  HX PZ2.54-1x3P WT  [HDR-SMD_3P-P2.54-H-M_KH-2.54PH-1X3P-L13.5-WT]  45.85 5.08 270 top
L1  1uH  [IND-SMD_L7.1-W6.6_DH0630H-R82M]  17.65 12.06 0 top
LED1  -  [LED_0603]  1.91 18.92 0 bottom
LED5  -  [LED_0603]  10.41 21.08 180 top
Q1  AO3400  [SOT-23_L2.9-W1.3-P1.90-LS2.4-BR]  10.22 24.8 180 top
Q2  AO3400  [SOT-23_L2.9-W1.3-P1.90-LS2.4-BR]  52.65 33.15 270 top
R1  2R  [R0603]  6.93 15.49 180 top
R2  10K  [R0603]  3.94 37.72 90 top
R3  5.1K  [R0603]  1.78 11.81 90 top
R4  5.1K  [R0603]  1.78 14.86 270 top
R5  0R5  [R0603]  20.76 7.49 0 top
R6  10K  [R0603]  10.54 7.62 0 top
R7  1K  [R0603]  10.57 19.3 180 top
R8  10K  [R0603]  35 29.12 0 top
R9  100K  [R0603]  23.2 26.19 0 top
R10  30R  [R0603]  12.06 28.17 90 top
R11  10K  [R0603]  8.76 28.17 270 top
R12  30R  [R0603]  49.29 34.91 180 top
R13  10K  [R0603]  49.29 31.61 0 top
R14  1K  [R0603]  10.41 28.17 90 top
R15  1K  [R0603]  49.29 33.26 180 top
R16  47K  [R0603]  43.74 21.29 90 top
R17  47K  [R0603]  40.19 21.29 90 top
R18  2R  [R0603]  41.97 21.29 90 top
R19  1K  [R0603]  38.41 21.29 90 top
R20  120R  [R0603]  48.77 4.19 270 top
R21  1K  [R0603]  6.35 7.62 180 top
SCREW1  -  [M2螺丝]  52.9 42.96 0 top
SCREW2  -  [M2螺丝]  52.9 2.07 0 top
SCREW3  -  [M2螺丝]  2.11 42.96 0 top
SCREW4  -  [M2螺丝]  1.99 2.07 0 top
SW1  6*3  [SW-SMD_L6.1-W3.6-LS7.0_YTS1C0161BBJ00]  2.03 29.34 90 bottom
SW2  TS-1088-AR02016  [SW-SMD_L3.9-W3.0-P4.45]  2.03 35.43 270 bottom
U1  IP5306  [ESOP-8_L4.9-W3.9-P1.27-LS6.0-BL-EP]  8.51 11.56 270 top
U2  AMS1117-3.3  [SOT-223-4_L6.5-W3.5-P2.30-LS7.0-BR]  20.94 19.93 180 top
U3  GH1.25-4P  [CONN-SMD_4P-P1.25_XUNPU_WAFER-GH1.25-4PWB]  51.31 25.91 90 top
U4  STM32G030F6P6TR  [TSSOP-20_L6.5-W4.4-P0.65-LS6.4-BL]  29.04 28.54 90 top
U5  GH1.25-4P  [CONN-SMD_4P-P1.25_XUNPU_WAFER-GH1.25-4PWB]  3.56 25 270 top
U6  SP3485EN-L/TR  [SOIC-8_L5.0-W4.0-P1.27-LS6.0-BL]  41.2 16.84 270 top
U7  MC-306LS-H735  [USB-C-SMD_MC-306LS-H60]  2.5 13.25 270 bottom
X1  GH125-S03DCA-00  [CONN-SMD_3P-P1.25_JUSHUO_GH125-S03DCA-00]  51.44 17.4 90 top
X2  GH125-S03DCA-00  [CONN-SMD_3P-P1.25_JUSHUO_GH125-S03DCA-00]  51.44 9.65 90 top

## Footprints (pads in the part's own frame, mm; a bottom-side part is the same pattern mirrored in y, then rotated)
C0603
  rect 0.8x0.9 smd: 1(-0.7,0) 2(0.7,0)
CONN-SMD_3P-P1.25_JUSHUO_GH125-S03DCA-00
  rect 0.7x1.8 smd: 1(-1.25,1.75) 2(0,1.75) 3(1.25,1.75)
  rect 1x2.7 smd: 4(3.08,-1.75) 5(-3.08,-1.75)
CONN-SMD_4P-P1.25_XUNPU_WAFER-GH1.25-4PWB
  rect 0.6x1.7 smd: 1(-1.875,1.575) 2(-0.625,1.575) 3(0.625,1.575) 4(1.875,1.575)
  rect 1x2.8 smd: 5(3.725,-1.575) 6(-3.725,-1.575)
CONN-TH_2P-P2.50_HX-2.54MM-2P-ZZ-MS
  rect 1.5x1.5 hole 1: 1(-1.25,0)
  round 1.5 hole 1: 2(1.25,0)
ESOP-8_L4.9-W3.9-P1.27-LS6.0-BL-EP
  rect 0.6x1.2 smd: 1(-1.905,-2.909) 2(-0.635,-2.909) 3(0.635,-2.909) 4(1.905,-2.909) 5(1.905,2.909) 6(0.635,2.909) 7(-0.635,2.909) 8(-1.905,2.909)
  rect 3.3x2.4 smd: 9(0,0)
HDR-SMD_3P-P2.54-H-M_KH-2.54PH-1X3P-L13.5-WT
  rect 1.02x3.2 smd: 1(-2.54,0) 2(0,0) 3(2.54,0)
HDR-TH_4P-P2.54-H-M-W10.4
  rect 1.8x1.8 hole 1.1: 1(-3.81,0)
  round 1.8 hole 1.1: 2(-1.27,0) 3(1.27,0) 4(3.81,0)
IND-SMD_L7.1-W6.6_DH0630H-R82M
  rect 2.45x3.5 smd: 1(-3.025,0) 2(3.025,0)
LED_0603
  rect 0.8x0.8 smd: 1(-0.851,-0.01) 2(0.75,-0.005)
M2螺丝
  round 2 hole 2: 1(0,0)
R0603
  rect 0.806x0.864 smd: 1(-0.753,0) 2(0.753,0)
SMA_L4.3-W2.6-LS5.0-BI
  rect 2x2 smd: 1(-2.2,0) 2(2.2,0)
SOIC-8_L5.0-W4.0-P1.27-LS6.0-BL
  oval 0.569x1.95 smd: 1(-1.905,-2.705) 2(-0.635,-2.705) 3(0.635,-2.705) 4(1.905,-2.705) 5(1.905,2.705) 6(0.635,2.705) 7(-0.635,2.705) 8(-1.905,2.705)
SOT-23_L2.9-W1.3-P1.90-LS2.4-BR
  rect 1x0.8 smd: 1(1.15,-0.95) 2(1.15,0.95) 3(-1.15,0)
SOT-223-4_L6.5-W3.5-P2.30-LS7.0-BR
  rect 2.47x0.98 smd: 1(2.835,-2.3) 2(2.835,0) 3(2.835,2.3)
  rect 2.47x3.6 smd: 4(-2.835,0)
SW-SMD_L3.9-W3.0-P4.45
  rect 1.23x1.86 smd: 1(-2.185,0) 2(2.185,0)
SW-SMD_L6.1-W3.6-LS7.0_YTS1C0161BBJ00
  rect 1.1x1.6 smd: 1(-3.05,0) 2(3.05,0)
TSSOP-20_L6.5-W4.4-P0.65-LS6.4-BL
  oval 0.364x1.742 smd: 1(-2.925,-2.871) 2(-2.275,-2.871) 3(-1.625,-2.871) 4(-0.975,-2.871) 5(-0.325,-2.871) 6(0.325,-2.871) 7(0.975,-2.871) 8(1.625,-2.871) 9(2.275,-2.871) 10(2.925,-2.871) 11(2.925,2.871) 12(2.275,2.871) 13(1.625,2.871) 14(0.975,2.871) 15(0.325,2.871) 16(-0.325,2.871) 17(-0.975,2.871) 18(-1.625,2.871) 19(-2.275,2.871) 20(-2.925,2.871)
USB-C-SMD_MC-306LS-H60
  oval 1x1.7 hole 0.5x1.3: 1(-4.32,0.39) 2(4.32,0.39)
  rect 0.8x2 smd: A5(-0.5,-0.39) A9(1.5,-0.39) A12(2.7,-0.39) B5(0.5,-0.39) B9(-1.5,-0.39) B12(-2.7,-0.39)

## Nets
As in the schematic.

Pads without a net: H2 1; SCREW1 1; SCREW2 1; SCREW3 1; SCREW4 1; U3 5 6; U4 2 3 9 10 11 12 13 14 17; U5 5 6; U7 1 2; X1 4 5; X2 4 5

## Via types
v1: diameter 1.219, hole 0.61, Top Layer to Bottom Layer, 21 vias
v2: diameter 0.61, hole 0.305, Top Layer to Bottom Layer, 109 vias

## Routing (per net, layer and track width the routed paths; a pad name or vN(x,y) marks a point on that pad's centre or on a via; arc(x,y) is an arc through that point)
+3.3V: length 87.2
  Top Layer w0.508: 14.31,31.88 7.24,31.88 5.97,33.15 5.97,37.97 5.47,38.47 R2.2 ; 14.31,31.88 20.57,31.88 21.69,33 21.69,34.31 H1.1 37.08,34.42 37.59,33.91 37.59,29.22 ; 14.31,31.88 14.31,21.42 15.07,20.66 15.07,20.63 C6.1 17.99,20.04 U2.2 23.78,19.93 ; R8.2 37.47,29.12 ; U4.4 34.12,27.57 C10.1 C11.1 37.21,27.43 37.59,27.81 37.59,29.22 ; 37.59,29.22 37.73,29.08 v1(40.19,29.08) ; v1(40.19,25.15) R17.2 R18.2
  Bottom Layer w0.508: v1(40.19,25.15) v1(40.19,29.08)
+5V: length 84
  Top Layer w0.508: C3.1 11.21,19.19 R7.1 ; C3.1 12.06,17.4 13.59,15.88 15.63,15.88 ; C3.1 C4.1 12.43,15.49 12.93,14.99 12.93,13.82 12.57,13.46 U1.8 ; C7.2 15.66,15.91 15.63,15.88 ; C7.2 15.66,17.87 14.73,18.8 12.95,18.8 12.59,19.16 12.59,22.33 12.06,22.86 8.25,22.86 7.99,23.12 U5.4 3.93,23.12 3.68,23.37 3.68,24.13 3.93,24.38 U5.3 ; C7.2 18.11,17.63 ; 15.63,15.88 33.91,15.88 34.16,16.13 34.16,23.62 34.9,24.36 38.33,24.36 38.86,24.89 38.86,26.03 39.34,26.51 51.03,26.51 51.18,26.67 51.18,27.56 50.98,27.76 49.73,27.76
GND:
  vias: v1(49.91,38.73) v1(49.91,36.83) v1(51.67,38.73) v1(51.69,36.83) v1(53.54,38.73) v1(53.54,36.83) v2(0.64,16.26) v2(0.64,15.54) v2(5.97,31.37) v2(5.97,30.53) v2(6.7,17.81) v2(6.94,14.42) v2(6.86,10.8) v2(6.86,9.65) v2(6.98,12.83) v2(6.98,11.88) v2(7.27,18.34) v2(7.75,9.4) v2(7.75,14.42) v2(7.87,12.7) v2(7.95,11.88) v2(7.95,10.92) v2(9.02,9.4) v2(9.14,10.92) v2(9.17,12.7) v2(9.17,11.88) v2(9.65,14.48) v2(10.43,14.48) v2(12.45,18.16) v2(13.21,26.03) v2(13.21,25.18) v2(13.21,17.65) v2(13.46,22.13) v2(13.46,21.21) v2(15.4,26.95) v2(15.4,25.99) v2(16.26,21.77) v2(17.02,21.34) v2(17.5,26.95) v2(17.5,26.1) v2(17.75,21.34) v2(18.5,21.34) v2(20.14,25.91) v2(20.32,21.97) v2(20.45,21.08) v2(20.45,17.78) v2(20.37,17.02) v2(21.21,25.91) v2(21.46,21.97) v2(21.46,21.08) v2(21.46,17.78) v2(21.46,17.02) v2(22.99,17.65) v2(22.99,16.96) v2(22.99,14.61) v2(23.24,22.22) v2(24.07,22.22) v2(24.05,17.65) v2(24.09,16.96) v2(24.09,14.57) v2(25.31,24.38) v2(26.29,24.38) v2(28.95,20.08) v2(28.95,19.2) v2(29.12,32.38) v2(29.75,20.08) v2(29.76,19.2) v2(30.08,32.38) v2(30.35,28.7) v2(30.35,27.92) v2(30.35,27.14) v2(30.35,26.33) v2(30.57,20.08) v2(30.61,19.2) v2(30.7,24.33) v2(30.7,23.42) v2(31.65,24.33) v2(31.68,23.42) v2(36.62,31.17) v2(36.62,30.38) v2(40.27,14.61) v2(42.29,14.61)
VBAT: length 30.9
  Top Layer w0.508: R21.1 7.24,7.48 7.24,6.22 7.62,5.84 CN1.1 13.36,5.72 13.36,2.9 13.72,2.54 21.21,2.54 21.4,2.73 C9.2 21.51,3.83 22.25,3.83 22.61,4.19 22.61,7.24 22.35,7.49 R5.2 21.51,11.23 L1.2
120R+: length 37
  Top Layer w0.254: v2(45.97,16.21) U6.6 41.86,16.21 41.02,15.37 40.51,15.37 40.19,15.69 R17.1 ; D3.2 47.32,18.69 v2(47.32,17.55) 49.53,17.55 X1.2 51.43,17.4 51.56,17.27 51.56,9.91 51.3,9.65 X2.2 48.54,9.65 47.88,8.99 47.88,5.33 47.5,4.95 45.97,4.95 H2.2
  Bottom Layer w0.254: v2(45.97,16.21) v2(47.32,17.55)
  vias: v2(46.48,19.09)
120R-: length 37
  Top Layer w0.254: 47.37,16.13 49.66,16.13 X1.1 49.71,16.13 50.93,16.13 51.02,16.03 51.02,14.98 50.84,14.81 49.2,14.81 49.02,14.63 49.02,13.46 49.2,13.28 50.84,13.28 51.02,13.1 51.02,11.81 ; 47.37,16.13 47.37,15.28 D1.1 ; 47.37,16.13 46.02,17.48 U6.7 v2(42.42,17.48) ; R20.1 48.51,5.2 48.51,8.25 48.66,8.4 X2.1 49.71,8.38 v2(50.97,8.38) ; v2(43.56,19.69) 43.74,19.87 R16.1
  Bottom Layer w0.254: v2(50.97,8.38) 50.97,9.23 51.15,9.41 53.48,9.41 53.85,9.78 53.85,10.54 53.46,10.93 51.15,10.93 50.97,11.11 v2(50.97,11.81) ; v2(42.42,17.48) 42.42,18.54 v2(43.56,19.69)
  vias: v2(46.48,14.69)
BLUE: length 80.4
  Top Layer w0.508: v1(35.69,17.4) 35.69,23.23 v1(35.7,23.24) ; v1(16.17,23.37) 26.03,23.37 26.8,22.61 26.8,17.91 27.31,17.4 v1(32.36,17.4) ; U5.2 v1(6.73,25.62) ; R12.2 47.1,34.91 46.5,34.3 46.5,29.32 47.12,28.7 51.69,28.7 52.58,27.81 52.58,25.53 52.31,25.26 49.73,25.26
  Bottom Layer w0.508: v1(6.73,25.62) 6.73,23.75 7.11,23.37 v1(16.17,23.37) ; v1(35.7,23.24) 50.93,23.24 51.56,23.88 v1(51.56,25.27) ; v1(32.36,17.4) v1(35.69,17.4)
BOOT0/CLK: length 19.9
  Top Layer w0.254: v2(16.51,29.46) v2(16.51,31.11) ; U4.19 24.04,26.27 R9.2 23.96,25.23 23.75,25.02 16.89,25.02 16.51,25.4 v2(16.51,28.07)
  Bottom Layer w0.254: v2(16.51,31.11) H1.3 ; v2(16.51,28.07) v2(16.51,29.46)
KEY: length 42.5
  Top Layer w0.254: v2(33.27,36.96) v2(6.98,36.96) ; v2(2.24,35.94) C5.1 3.92,36.98 R2.1 3.95,36.96 v2(4.95,36.96) ; 31.92,29.52 33.07,29.52 33.27,29.72 v2(33.27,33.02)
  Bottom Layer w0.254: v2(33.27,33.02) v2(33.27,36.96) ; SW2.1 2.24,37.41 v2(2.24,35.94) ; v2(6.98,36.96) v2(4.95,36.96)
NRST: length 4.1
  Top Layer w0.254: 31.92,28.87 33.99,28.87 R8.1 34.3,29.18 34.3,30.77
RED: length 64.2
  Top Layer w0.508: v1(43,28.35) 43,34.6 41.91,35.69 v1(24,35.69) ; U5.1 6.68,26.88 7.11,27.31 7.11,29.84 7.49,30.23 v1(11.96,30.23) 11.96,30.08 11.99,30.05 11.99,29 R10.2 ; v1(43,25.07) 43.69,25.76 47.67,25.76 48.03,25.4 48.03,24.37 48.39,24.01 49.73,24.01 ; v1(20.57,30.23) 21.08,30.23 v1(23.88,33.02)
  Bottom Layer w0.508: v1(43,25.07) v1(43,28.35) ; v1(20.57,30.23) v1(11.96,30.23) ; v1(24,35.69) 23.88,35.56 v1(23.88,33.02)
RX: length 13.5
  Top Layer w0.254: v2(33.02,18.8) 33.02,25.53 32.93,25.62 U4.1 ; v2(36.58,18.92) 38.32,18.92 U6.1
  Bottom Layer w0.254: v2(33.02,18.8) 33.15,18.92 v2(36.58,18.92)
SET: length 18.6
  Top Layer w0.254: v2(32.26,22.1) 30.35,22.1 29.59,22.86 29.59,29.84 29.97,30.23 31.86,30.23 U4.8 ; R19.2 38.35,22.1 v2(36.7,22.1)
  Bottom Layer w0.254: v2(32.26,22.1) v2(36.7,22.1)
SIGNAL-B: length 27.5
  Top Layer w0.254: U4.16 27.58,28.22 27.69,28.32 27.69,32.89 28.45,33.66 v2(36.45,33.66) ; R15.2 47.76,33.26 v2(47.37,33.66)
  Bottom Layer w0.254: v2(36.45,33.66) v2(47.37,33.66)
SIGNAL-R: length 16.8
  Top Layer w0.254: v2(13.15,28.26) 13.22,28.19 10.54,28.19 10.41,28.32 R14.2 ; v2(15.37,28.87) 26.17,28.87
  Bottom Layer w0.254: v2(15.37,28.87) 13.76,28.87 v2(13.15,28.26)
SWDIO: length 14.6
  Top Layer w0.254: v2(19.05,26.92) 21.08,26.92 21.08,26.92 U4.18 ; v2(19.05,31.11) v2(19.05,29.46)
  Bottom Layer w0.254: v2(19.05,29.46) v2(19.05,26.92) ; H1.2 v2(19.05,31.11)
TX: length 23
  Top Layer w0.254: v2(27.56,14.86) 38.42,14.86 U6.4 ; v2(27.56,18.97) 27.56,25.4 27.34,25.62 U4.20
  Bottom Layer w0.254: v2(27.56,18.97) v2(27.56,14.86)
$1N12: length 3.6
  Top Layer w0.254: v2(3.94,13.75) 2.14,13.75 R4.2
  Bottom Layer w0.254: 2.64,13.75 v2(3.94,13.75)
$1N13: length 3.5
  Top Layer w0.254: v2(3.94,12.75) 1.96,12.75 R3.2
  Bottom Layer w0.254: 2.64,12.75 v2(3.94,12.75)
$1N16: length 17.3
  Top Layer w0.508: C1.2 5.21,19.05 4.85,18.69 4.85,15.26 ; 4.85,15.26 4.85,15.14 v1(4.57,14.86) 4.65,14.78 4.65,13.77 4.95,13.46 U1.1 ; 4.85,15.26 5.08,15.49 R1.2
  Bottom Layer w0.508: v1(4.57,14.86) 4.46,14.75 1.25,14.75 0.73,14.22 0.73,12.29 1.27,11.75 2.64,11.75
$1N18: length 1.8
  Top Layer w0.508: C2.2 7.68,17.27 7.68,15.49
$1N30: length 3.3
  Top Layer w0.508: U1.7 14.5,12.19 L1.1
$1N32: length 13.8
  Top Layer w0.508: C8.2 21.4,6.1 R5.1 13.5,7.49 13,8 13,10.5 12.59,10.9 11.44,10.9 U1.6
$1N34: length 4.3
  Top Layer w0.254: R6.2 11.47,7.44 12.27,7.44 12.45,7.62 12.45,9.53 12.32,9.65 U1.5
$1N36: length 25.8
  Top Layer w0.254: v2(6.98,20.07) 8.38,20.07 8.64,19.81 8.64,13.84 8.82,13.66 9.7,13.66 10.29,13.08 10.29,8.12 R6.1
  Bottom Layer w0.254: v2(6.98,20.07) 5.72,21.34 2.16,21.34 1.98,21.52 1.98,26.23 SW1.1
$1N44: length 1.8
  Top Layer w0.508: 9.66,21.09 9.81,20.94 R7.2
$1N72: length 3.4
  Top Layer w0.254: Q1.1 9.07,27.11 R11.2 R14.1
$1N73: length 3.1
  Top Layer w0.508: Q1.3 11.77,24.8 12.06,25.1 R10.1
$1N104: length 3.7
  Top Layer w0.254: R20.2 48.77,2.67 48.64,2.54 H2.3
$1N114: length 3.5
  Top Layer w0.508: R18.1 41.97,19.13 42.35,18.75 U6.8
$1N119: length 9.1
  Top Layer w0.254: R19.1 38.41,19.94 38.67,19.69 39.63,19.69 39.81,19.51 39.81,17.6 39.69,17.48 U6.2 37.4,17.48 37.27,17.35 37.27,16.33 37.45,16.15 38.44,16.15 U6.3
$1N129: length 3.5
  Top Layer w0.254: Q2.1 51.32,31.61 R13.2 R15.1
$1N130: length 3.2
  Top Layer w0.508: R12.1 52.58,34.91 52.65,34.84 Q2.3
$1N134: length 11.6
  Top Layer w0.254: v2(4.57,12.06) 4.7,12.19 U1.2
  Bottom Layer w0.254: LED1.2 5.08,18.93 5.59,18.42 5.59,12.06 v2(4.57,12.06)
$1N135: length 6.3
  Top Layer w0.254: 4.57,9.65 4.57,10.8 4.7,10.92 U1.3 ; 4.57,9.65 U1.4 ; 4.57,9.65 4.57,7.75 4.75,7.57 5.54,7.57 R21.2

## Copper pours and planes (outline as drawn; the poured copper is in the pictures)
GND on Top Layer: -9.53,57.78 -5.97,54.23 69.09,54.23 69.09,-9.78 68.2,-10.67 61.85,-4.32 -7.49,-4.32 -9.53,-2.29
GND on Bottom Layer: -0.51,49.15 59.31,49.15 60.07,48.39 60.07,-4.06 59.56,-4.57 -3.05,-4.57 -3.43,-4.19 -3.43,46.23

Small or netless copper shapes (teardrops, artwork), in the pictures only: 182 on Top Layer, 56 on Bottom Layer

## Text on the board
Bottom Silkscreen Layer: 挤一挤还是塞得下（（
Top Silkscreen Layer: M2 | G | CLK | DIO | 3V3 | 2026.3 | By BZD | 120R | RGB | RS485 | + | FENGXINZI | 5V指示 | 板背绿灯闪烁：充电中（电量低） / 板背绿灯常亮：充满电（放电中） | 手持装甲板
